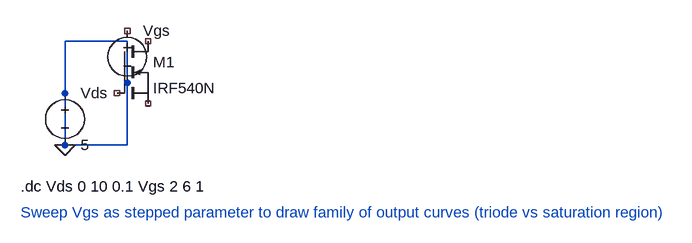
[diagram p0: schematic 12_MOSFET_IV_curve.asc]
12_MOSFET_IV_curve.asc, the LTspice schematic file:
Version 4
SHEET 1 880 680
WIRE 224 96 128 96
WIRE 128 176 128 96
WIRE 224 176 224 96
WIRE 128 256 128 176
WIRE 224 256 224 176
WIRE 224 256 128 256
FLAG 128 256 0
SYMBOL voltage 128 160 R0
SYMATTR InstName Vds
SYMATTR Value 5
SYMBOL voltage 224 64 R0
WINDOW 3 -60 40 Invisible 2
SYMATTR InstName Vgs
SYMATTR Value 4
SYMBOL nmos 208 96 R0
SYMATTR InstName M1
SYMATTR Value IRF540N
TEXT 60 320 Left 2 !.dc Vds 0 10 0.1 Vgs 2 6 1
TEXT 60 360 Left 2 ;Sweep Vgs as stepped parameter to draw family of output curves (triode vs saturation region)

The netlist it stands for:
* 12_MOSFET_IV_curve.asc
Vds 0 0 5
Vgs NC_01 0 4
M1 NC_02 NC_03 NC_04 NC_04 IRF540N
.model NMOS NMOS
.model PMOS PMOS
.lib standard.mos
.dc Vds 0 10 0.1 Vgs 2 6 1
* Sweep Vgs as stepped parameter to draw family of output curves (triode vs saturation region)
.backanno
.end